# Altium schematic sheet 3V3-CAN-UNISOLATED.SchDoc
size A4; Organization: UNSW Solar Racing Team; Address3: UNSW; Address4: Sydney NSW 2052; Address2: Electrical Engineering; Address1: Rm 109
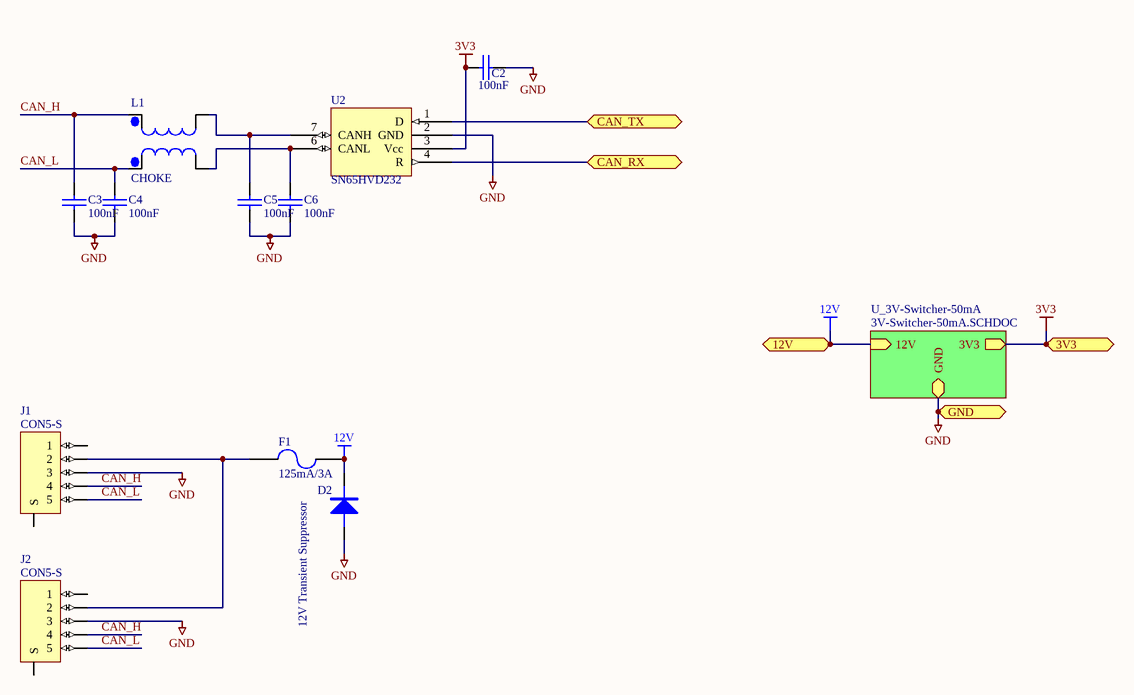
[diagram p0: 3V3-CAN-UNISOLATED.SchDoc]

## Parts
C2  100nF  [0603]
C3  100nF  [0603]
C4  100nF  [0603]
C5  100nF  [0603]
C6  100nF  [0603]
D2  12V Transient Suppressor  [SMA]
F1  125mA/3A  [LITTELFUSE-154]
J1  CON5-S  [TRIAD5F]
J2  CON5-S  [TRIAD5F]
L1  CHOKE  [Epcos-Choke]
U2  SN65HVD232  [SO8]

## Sub-sheets
U_3V-Switcher-50mA = 3V-Switcher-50mA.SCHDOC: GND, 3V3, 12V

## Ports
3V3, 12V, CAN_RX, CAN_TX, GND

## Nets
3V3: C2.2 U2.3(Vcc) ; port 3V3, sheet U_3V-Switcher-50mA/3V3
12V: D2.K F1.2 ; port 12V, sheet U_3V-Switcher-50mA/12V
GND: C2.1 C3.1 C4.2 C5.2 C6.2 D2.A J1.3 J2.3 U2.2(GND) ; port GND, sheet U_3V-Switcher-50mA/GND
CAN_H: C3.2 J1.4 J2.4 L1.1
CAN_L: C4.1 J1.5 J2.5 L1.2
CAN_RX: U2.4(R) ; port CAN_RX
CAN_TX: U2.1(D) ; port CAN_TX
NetC5_1: C5.1 L1.4 U2.7(CANH)
NetC6_1: C6.1 L1.3 U2.6(CANL)
NetF1_1: F1.1 J1.2 J2.2

Not connected (* = marked no-connect by the designer): J1 0(S) 1; J2 0(S) 1

## Notes on the sheet
- Title
- Size:
- Date:
- A4
- Number:
- Time:
- Revision:
- Sheet
- of
- File:

## Library data of the parts
C2-C6 = CAP: Capacitor; Order#: 753-567; Price: 0.31; Supplier: Farnell
D2 = DIODE: Order#: 980-2754; Price: 1.25; Supplier: Farnell
F1 = FUSE2: Fuse; Order#: 994-3609; Other Info: www.littelfuse.com; Price: 7.78; Supplier: Farnell
J1 J2 = CON5-S: Connector, 2 pin, with shield @ S; Order#: 131-040; Price: 23.50; Supplier: Farnell
U2 = SN65HVD232: 3.3V CAN Transciever; Order#: 296-12282-5-ND; Supplier: Digikey; Price: 2.93